# Altium project FOS-00 Rev 1_4.PrjPcb
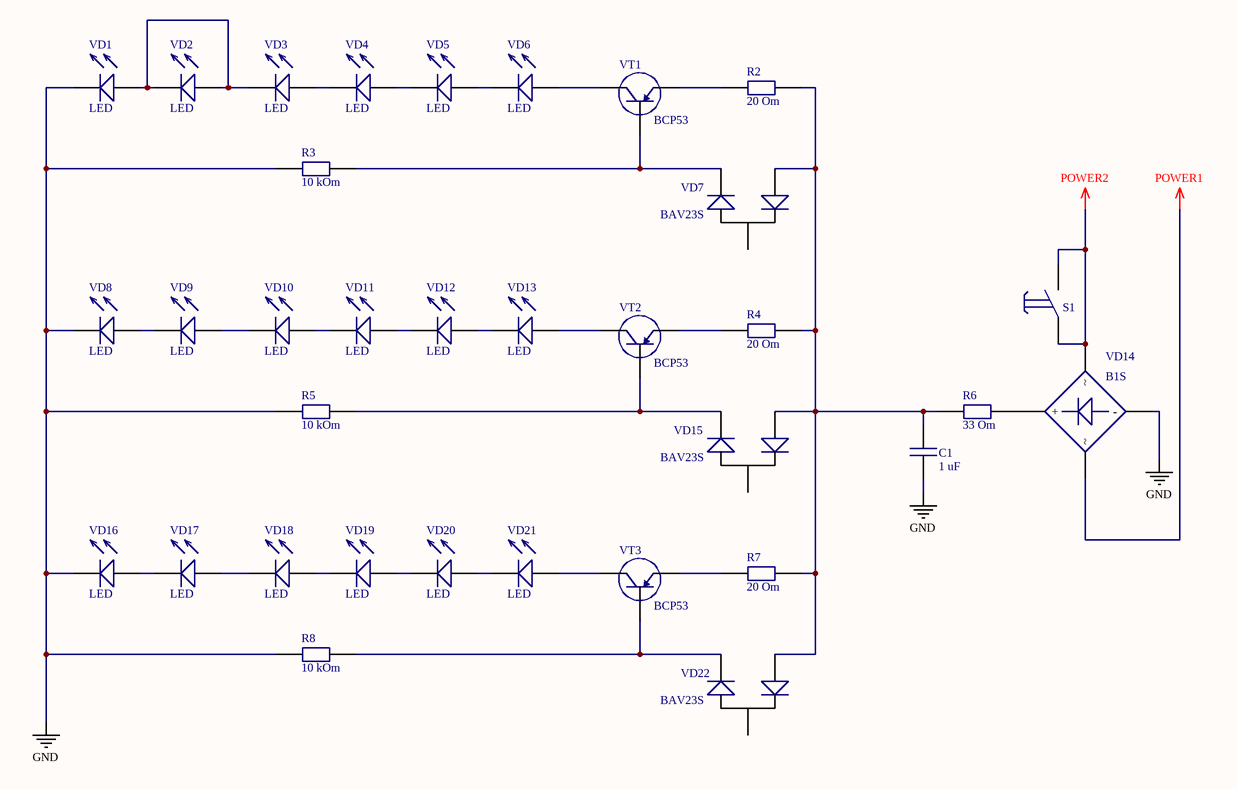
[diagram p0: FOS-00 Rev 1_3.SchDoc]
1 sheet, 34 parts. Net scope: global (net labels, ports and power ports of the same name join across sheets).
Board files: FOS 00_01 Rev 1_6.PcbDoc, FOS 00 MULTIPLATE Rev 1_5.PcbDoc, FOS 00 Rev 1_5.PcbDoc, FOS 00_01 MULTIPLATE Rev 1_6.PcbDoc

## Sheet FOS-00 Rev 1_3.SchDoc
size A4

### Parts
C1  value 1 uF  [CAP1206]  (hidden comment: Capacitor)
R2  value 20 Om  [RES1206]  (hidden comment: Resistor)
R3  value 10 kOm  [RES1206]  (hidden comment: Resistor)
R4  value 20 Om  [RES1206]  (hidden comment: Resistor)
R5  value 10 kOm  [RES1206]  (hidden comment: Resistor)
R6  value 33 Om  [RES1206]  (hidden comment: Resistor)
R7  value 20 Om  [RES1206]  (hidden comment: Resistor)
R8  value 10 kOm  [RES1206]  (hidden comment: Resistor)
S1  button  [button1]  (value not drawn)
VD1  LED  [LED_SAKURA]
VD2  LED  [LED_SAKURA]
VD3  LED  [LED_SAKURA]
VD4  LED  [LED_SAKURA]
VD5  LED  [LED_SAKURA]
VD6  LED  [LED_SAKURA]
VD7  BAV23S  [SOT 23]
VD8  LED  [LED_SAKURA]
VD9  LED  [LED_SAKURA]
VD10  LED  [LED_SAKURA]
VD11  LED  [LED_SAKURA]
VD12  LED  [LED_SAKURA]
VD13  LED  [LED_SAKURA]
VD14  value B1S  [db-1ms]  (hidden comment: Diode Bridge)
VD15  BAV23S  [SOT 23]
VD16  LED  [LED_SAKURA]
VD17  LED  [LED_SAKURA]
VD18  LED  [LED_SAKURA]
VD19  LED  [LED_SAKURA]
VD20  LED  [LED_SAKURA]
VD21  LED  [LED_SAKURA]
VD22  BAV23S  [SOT 23]
VT1  value BCP53  [SOT223]  (hidden comment: PNP)
VT2  value BCP53  [SOT223]  (hidden comment: PNP)
VT3  value BCP53  [SOT223]  (hidden comment: PNP)

### Nets
GND: C1.1 R3.1 R5.1 R8.1 VD1.1 VD8.1 VD14.2(-) VD16.1
POWER1: VD14.3
POWER2: S1.1 S1.2 VD14.4
NetC1_2: C1.2 R2.2 R4.2 R6.1 R7.2 VD7.1 VD15.1 VD22.1
NetR2_1: R2.1 VT1.E
NetR3_2: R3.2 VD7.2 VT1.B
NetR4_1: R4.1 VT2.E
NetR5_2: R5.2 VD15.2 VT2.B
NetR6_2: R6.2 VD14.1(+)
NetR7_1: R7.1 VT3.E
NetR8_2: R8.2 VD22.2 VT3.B
NetVD1_2: VD1.2 VD2.1 VD2.2 VD3.1
NetVD3_2: VD3.2 VD4.1
NetVD4_2: VD4.2 VD5.1
NetVD5_2: VD5.2 VD6.1
NetVD6_2: VD6.2 VT1.K
NetVD8_2: VD8.2 VD9.1
NetVD9_2: VD9.2 VD10.1
NetVD10_2: VD10.2 VD11.1
NetVD11_2: VD11.2 VD12.1
NetVD12_2: VD12.2 VD13.1
NetVD13_2: VD13.2 VT2.K
NetVD16_2: VD16.2 VD17.1
NetVD17_2: VD17.2 VD18.1
NetVD18_2: VD18.2 VD19.1
NetVD19_2: VD19.2 VD20.1
NetVD20_2: VD20.2 VD21.1
NetVD21_2: VD21.2 VT3.K

Not connected (* = marked no-connect by the designer): VD7 3; VD15 3; VD22 3

### Library data of the parts
VT1-VT3 = PNP: pin to pad: B>1 E>3 K>2+4
VD1-VD6 VD8-VD13 VD16-VD21 = LED: Value: LED
VD7 VD15 VD22 = BAV23S: Value: BAV23S